# Altium schematic sheet POWER.SchDoc
size A
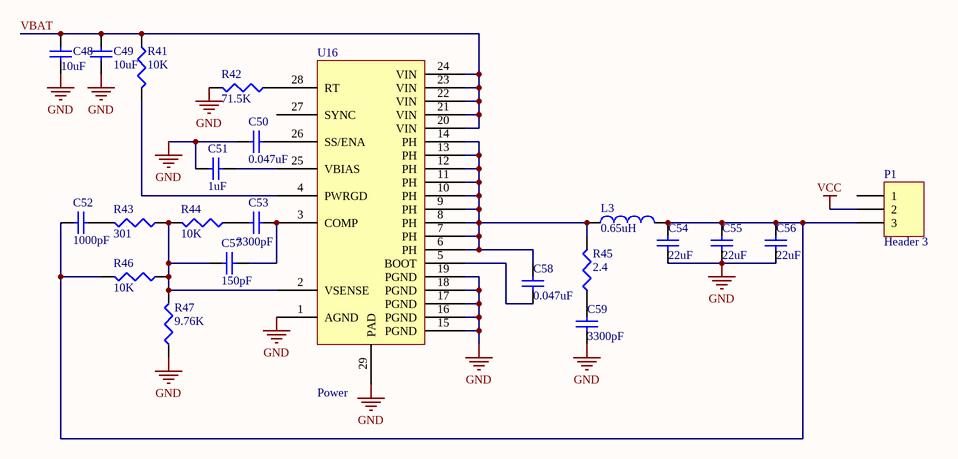
[diagram p0: POWER.SchDoc]

## Parts
C48  value 10uF  [CAPC1005L]  (hidden comment: Cap Semi)
C49  value 10uF  [CAPC1005L]  (hidden comment: Cap Semi)
C50  value 0.047uF  [CAPC1005L]  (hidden comment: Cap Semi)
C51  value 1uF  [CAPC1005L]  (hidden comment: Cap Semi)
C52  value 1000pF  [CAPC1005L]  (hidden comment: Cap Semi)
C53  value 3300pF  [CAPC1005L]  (hidden comment: Cap Semi)
C54  value 22uF  [CAPC1005L]  (hidden comment: Cap Semi)
C55  value 22uF  [CAPC1005L]  (hidden comment: Cap Semi)
C56  value 22uF  [CAPC1005L]  (hidden comment: Cap Semi)
C57  value 150pF  [CAPC1005L]  (hidden comment: Cap Semi)
C58  value 0.047uF  [CAPC1005L]  (hidden comment: Cap Semi)
C59  value 3300pF  [CAPC1005L]  (hidden comment: Cap Semi)
L3  0.65uH  [IndPow]
P1  Header 3  [HDR1X3]
R41  value 10K  [RESC1608L]  (hidden comment: Res3)
R42  value 71.5K  [RESC1608L]  (hidden comment: Res3)
R43  value 301  [RESC1608L]  (hidden comment: Res3)
R44  value 10K  [RESC1608L]  (hidden comment: Res3)
R45  value 2.4  [RESC1608L]  (hidden comment: Res3)
R46  value 10K  [RESC1608L]  (hidden comment: Res3)
R47  value 9.76K  [RESC1608L]  (hidden comment: Res3)
U16  Power  [TSOP_28_PowerPad]

## Nets
GND: C48.2 C49.2 C50.2 C51.2 C54.1 C55.1 C56.1 C59.1 R42.2 R47.1 U16.1(AGND) U16.15(PGND) U16.16(PGND) U16.17(PGND) U16.18(PGND) U16.19(PGND) U16.29(PAD)
VCC: P1.2
VBAT: C48.1 C49.1 R41.1 U16.20(VIN) U16.21(VIN) U16.22(VIN) U16.23(VIN) U16.24(VIN)
NetC50_1: C50.1 U16.26(SS/ENA)
NetC51_1: C51.1 U16.25(VBIAS)
NetC52_1: C52.1 C54.2 C55.2 C56.2 L3.2 P1.3 R46.2
NetC52_2: C52.2 R43.2
NetC53_1: C53.1 C57.1 U16.3(COMP)
NetC53_2: C53.2 R44.1
NetC57_2: C57.2 R43.1 R44.2 R46.1 R47.2 U16.2(VSENSE)
NetC58_1: C58.1 U16.5(BOOT)
NetC58_2: C58.2 L3.1 R45.2 U16.6(PH) U16.7(PH) U16.8(PH) U16.9(PH) U16.10(PH) U16.11(PH) U16.12(PH) U16.13(PH) U16.14(PH)
NetC59_2: C59.2 R45.1
NetR41_2: R41.2 U16.4(PWRGD)
NetR42_1: R42.1 U16.28(RT)

Not connected (* = marked no-connect by the designer): P1 1; U16 27(SYNC)

## Library data of the parts
C48-C59 = Cap Semi: Capacitor (Semiconductor SIM Model); Published: 8-Jun-2000; LatestRevisionDate: 29-May-2009; LatestRevisionNote: IPC-7351 Footprint Added.; PackageReference: C1206; Publisher: Altium Limited; PackageDescription: Chip Capacitor
L3 = Inductor: Value: 0.65uH
P1 = Header 3: Header, 3-Pin; LatestRevisionDate: 17-Jul-2002; LatestRevisionNote: Re-released for DXP Platform.; Publisher: Altium Limited
R41-R47 = Res3: Resistor; Published: 8-Jun-2000; LatestRevisionDate: 29-May-2009; LatestRevisionNote: IPC-7351 Footprint Added.; PackageReference: J1-0603; Publisher: Altium Limited; PackageDescription: Chip Resistor
U16 = Power_Switcher